# Altium schematic sheet Tp_7seg.SchDoc
size A4
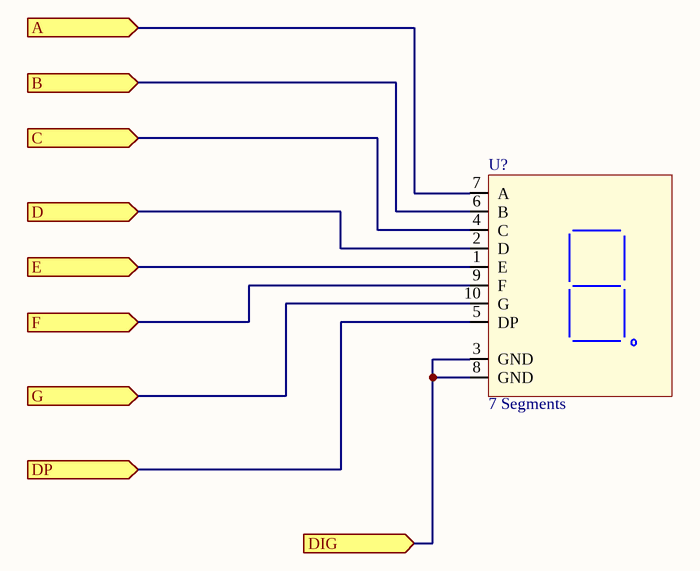
[diagram p0: Tp_7seg.SchDoc]

## Parts
U?  7 Segments  [SA10-21GWA]

## Ports
A (in), B (in), C (in), D (in), DIG (in), DP (in), E (in), F (in), G (in)

## Nets
A: U?.7(A) ; port A
B: U?.6(B) ; port B
C: U?.4(C) ; port C
D: U?.2(D) ; port D
DIG: U?.3(GND) U?.8(GND) ; port DIG
DP: U?.5(DP) ; port DP
E: U?.1(E) ; port E
F: U?.9(F) ; port F
G: U?.10(G) ; port G

## Library data of the parts
U? = SC10-21SRWA: KingBright Led 7 Segments; Reference: SC10-21SRWA